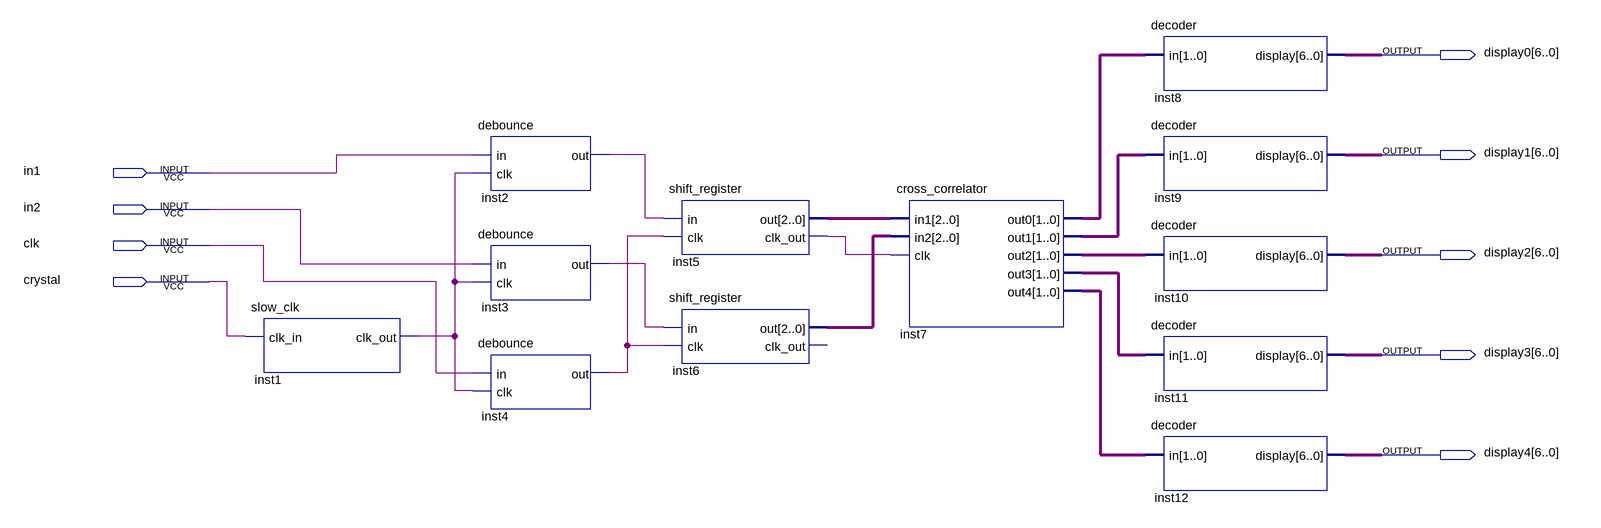
[diagram p0: schematic sheet]
// Quartus schematic Cross_correlation.bdf as structural Verilog: 12 symbols, 9 pins
module Cross_correlation (
  input  in1,
  input  in2,
  input  clk,
  input  crystal,
  output [6:0] display0,
  output [6:0] display1,
  output [6:0] display2,
  output [6:0] display3,
  output [6:0] display4
);

  wire inst1_clk_out, inst2_out, inst3_out, inst4_out, inst5_clk_out;
  wire [1:0] inst7_out0, inst7_out1, inst7_out2, inst7_out3, inst7_out4;
  wire [2:0] inst5_out, inst6_out;

  slow_clk inst1 (.clk_in(crystal), .clk_out(inst1_clk_out));
  debounce inst2 (.in(in1), .clk(inst1_clk_out), .out(inst2_out));
  debounce inst3 (.in(in2), .clk(inst1_clk_out), .out(inst3_out));
  debounce inst4 (.in(clk), .clk(inst1_clk_out), .out(inst4_out));
  shift_register inst5 (.in(inst2_out), .clk(inst4_out), .out(inst5_out), .clk_out(inst5_clk_out));
  shift_register inst6 (.in(inst3_out), .clk(inst4_out), .out(inst6_out));  // open: clk_out
  cross_correlator inst7 (
    .in1(inst5_out), .in2(inst6_out), .clk(inst5_clk_out), .out0(inst7_out0), .out1(inst7_out1),
    .out2(inst7_out2), .out3(inst7_out3), .out4(inst7_out4));
  decoder inst8 (.in(inst7_out0), .display(display0));
  decoder inst9 (.in(inst7_out1), .display(display1));
  decoder inst10 (.in(inst7_out2), .display(display2));
  decoder inst11 (.in(inst7_out3), .display(display3));
  decoder inst12 (.in(inst7_out4), .display(display4));
endmodule
